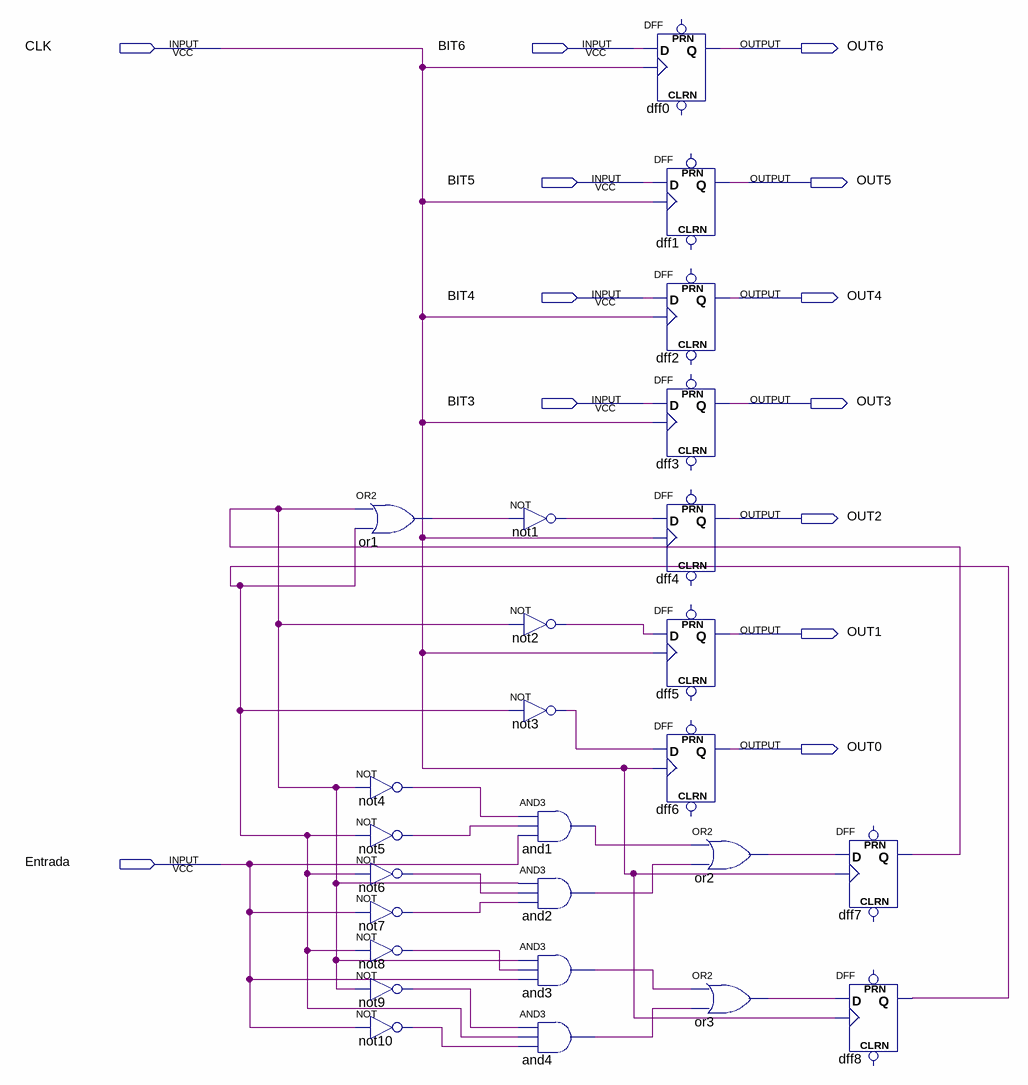
[diagram p0: schematic sheet]
// Quartus schematic letras.bdf as structural Verilog: 26 symbols, 13 pins
module letras (
  input  CLK,
  input  BIT6,
  input  BIT5,
  input  BIT4,
  input  BIT3,
  input  Entrada,
  output OUT6,
  output OUT5,
  output OUT4,
  output OUT3,
  output OUT2,
  output OUT1,
  output OUT0
);

  wire and1_out, and2_out, and3_out, and4_out, dff7_q, dff8_q, not1_out, not2_out, not3_out, not4_out,
       not5_out, not6_out, not7_out, not8_out, not9_out, not10_out, or1_out, or2_out, or3_out;

  or or1 (or1_out, dff7_q, dff8_q);
  not not4 (not4_out, dff7_q);
  not not5 (not5_out, dff8_q);
  not not6 (not6_out, dff8_q);
  not not7 (not7_out, Entrada);
  not not8 (not8_out, dff8_q);
  not not9 (not9_out, dff7_q);
  not not10 (not10_out, Entrada);
  not not1 (not1_out, or1_out);
  not not2 (not2_out, dff7_q);
  not not3 (not3_out, dff8_q);
  and and1 (and1_out, not4_out, not5_out, Entrada);
  and and2 (and2_out, dff7_q, not6_out, not7_out);
  and and3 (and3_out, dff7_q, not8_out, Entrada);
  and and4 (and4_out, not9_out, dff8_q, not10_out);
  DFF dff0 (.CLK(CLK), .D(BIT6), .Q(OUT6));  // open: CLRN, PRN
  DFF dff1 (.CLK(CLK), .D(BIT5), .Q(OUT5));  // open: CLRN, PRN
  DFF dff2 (.CLK(CLK), .D(BIT4), .Q(OUT4));  // open: CLRN, PRN
  DFF dff3 (.CLK(CLK), .D(BIT3), .Q(OUT3));  // open: CLRN, PRN
  DFF dff4 (.CLK(CLK), .D(not1_out), .Q(OUT2));  // open: CLRN, PRN
  DFF dff5 (.CLK(CLK), .D(not2_out), .Q(OUT1));  // open: CLRN, PRN
  DFF dff6 (.CLK(CLK), .D(not3_out), .Q(OUT0));  // open: CLRN, PRN
  or or2 (or2_out, and1_out, and2_out);
  or or3 (or3_out, and3_out, and4_out);
  DFF dff7 (.CLK(CLK), .D(or2_out), .Q(dff7_q));  // open: CLRN, PRN
  DFF dff8 (.CLK(CLK), .D(or3_out), .Q(dff8_q));  // open: CLRN, PRN
endmodule
